# EAGLE schematic GPS_radiologger_v3 (EAGLE 9.5.1)
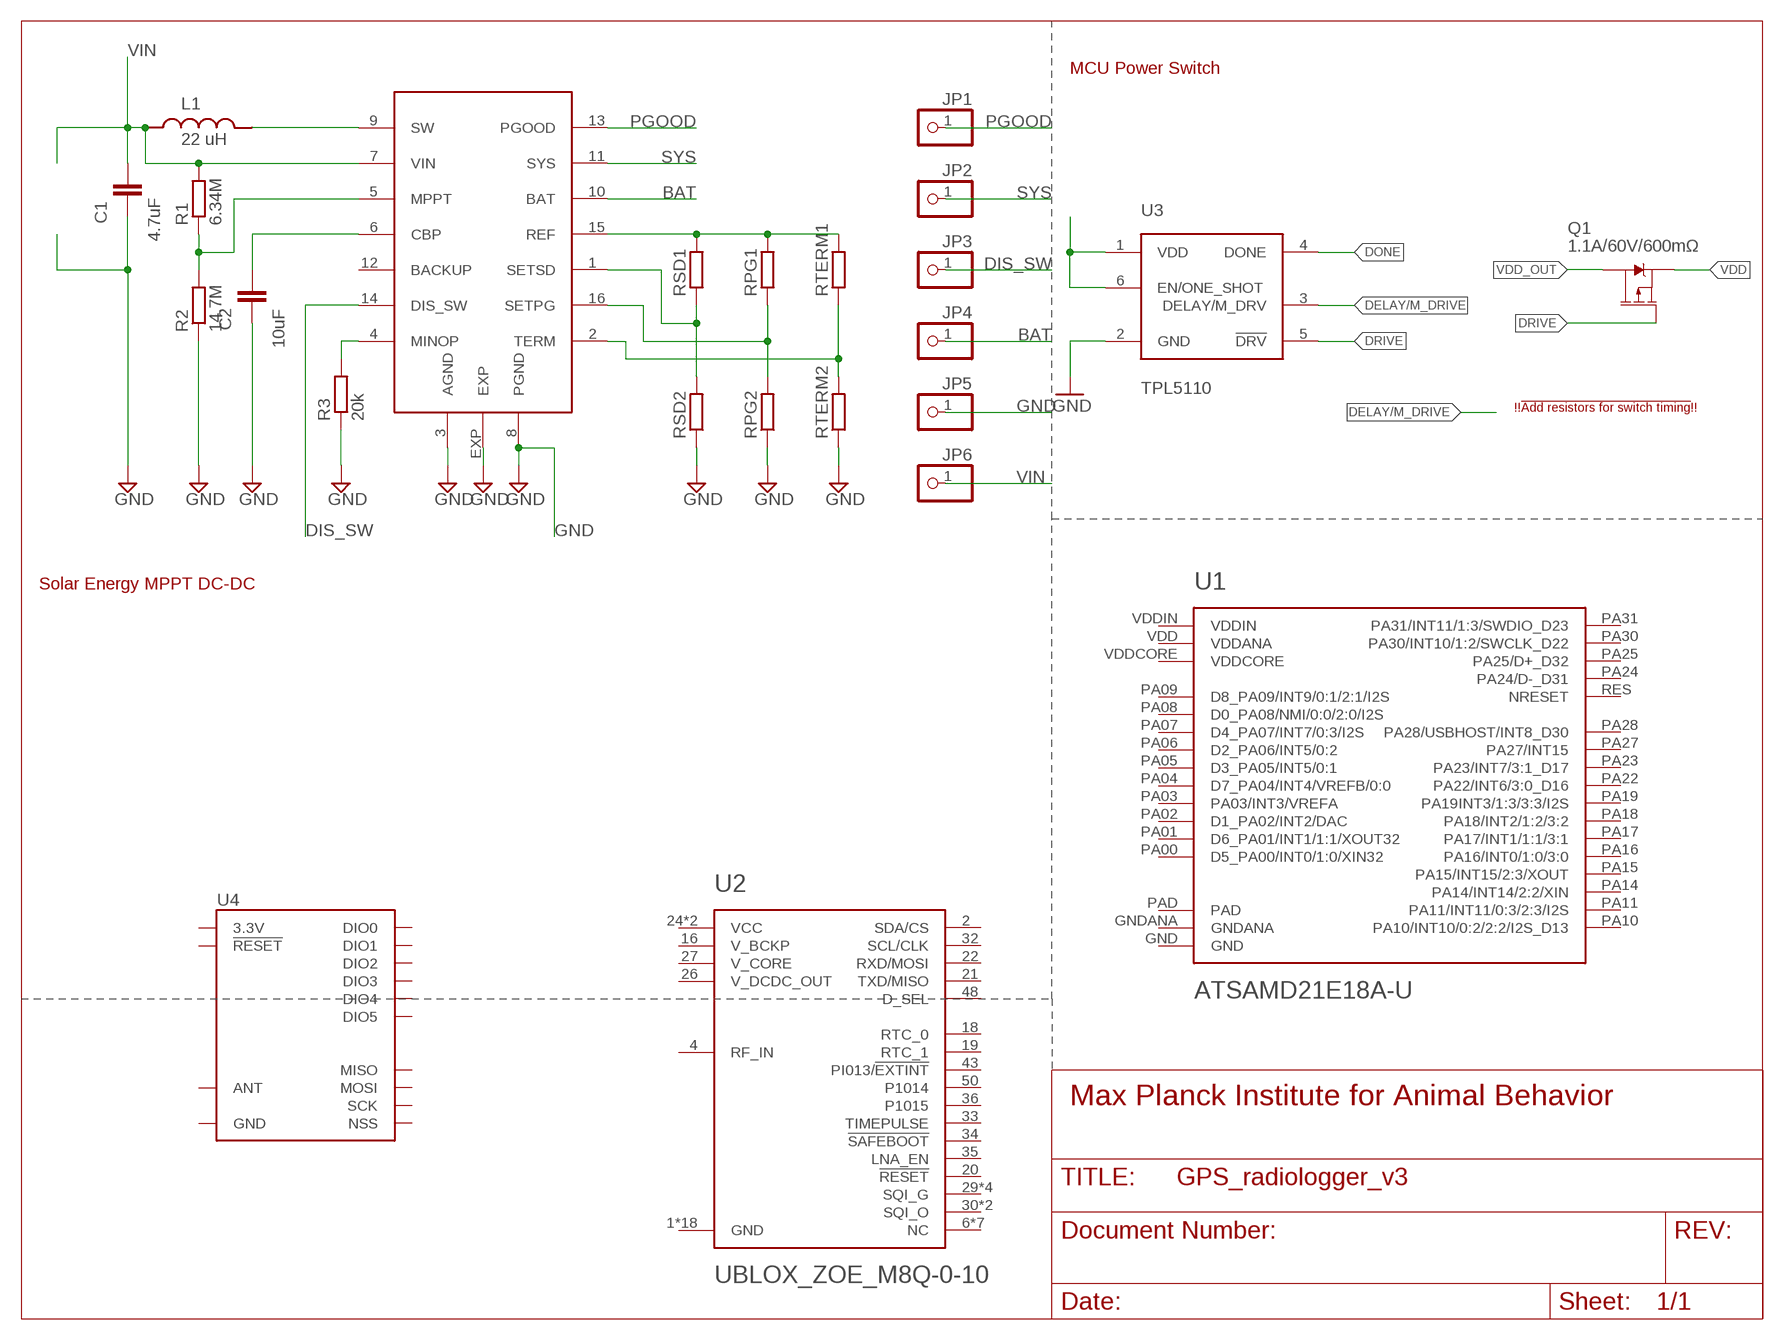
[diagram p0: schematic, sheet 1]

## Parts
C1  4.7uF  C-EUC0402  [C0402]
C2  10uF  C-EUC0402  [C0402]
JP1  PINHD-1X1  [1X01]
JP2  PINHD-1X1  [1X01]
JP3  PINHD-1X1  [1X01]
JP4  PINHD-1X1  [1X01]
JP5  PINHD-1X1  [1X01]
JP6  PINHD-1X1  [1X01]
L1  22 uH  LPS4012-103MRB  [IND_LPS4012-103MRB]
Q1  1.1A/60V/600mΩ  MOSFET_PCH-SI2309DS  [SOT23-3]
R1  6.34M  R-EU_R0201  [R0201]
R2  14.7M  R-EU_R0201  [R0201]
R3  20k  R-EU_R0201  [R0201]
RPG1  R-EU_R0201  [R0201]
RPG2  R-EU_R0201  [R0201]
RSD1  R-EU_R0402  [R0402]
RSD2  R-EU_R0201  [R0201]
RTERM1  R-EU_R0402  [R0402]
RTERM2  R-EU_R0201  [R0201]
U1  ATSAMD21E18A-U  [QFN-32_SAMD]
U2  UBLOX_ZOE_M8Q-0-10  [UBLOX_ZOE_M8-0-10]
U3  TPL5110  [SOT23-6]
U4  RFM95W  [RFM95/96/97/98W]
U$2  ADP5090  [LFCSP-16-3X3]

## Nets
BAT: JP4.1 U$2.10(BAT)
DELAY/M_DRIVE: U3.3(DELAY/M_DRV)
DIS_SW: JP3.1 U$2.14(DIS_SW)
DONE: U3.4(DONE)
DRIVE: Q1.1(G) U3.5(!DRV)
GND: C1.2 C2.2 JP5.1 R2.1 R3.1 RPG2.1 RSD2.1 RTERM2.1 U3.2(GND) U$2.3(AGND) U$2.8(PGND) U$2.EXP
N$1: R1.1 R2.2 U$2.5(MPPT)
N$2: C2.1 U$2.6(CBP)
N$3: L1.2 U$2.9(SW)
N$5: R3.2 U$2.4(MINOP)
N$6: U3.1(VDD) U3.6(EN/ONE_SHOT)
N$7: RTERM1.1 RTERM2.2 U$2.2(TERM)
N$8: RPG1.1 RPG2.2 U$2.16(SETPG)
N$9: RSD1.1 RSD2.2 U$2.1(SETSD)
N$11: RPG1.2 RSD1.2 RTERM1.2 U$2.15(REF)
PGOOD: JP1.1 U$2.13(PGOOD)
SYS: JP2.1 U$2.11(SYS)
VDD: Q1.2(S)
VDD_OUT: Q1.3(D)
VIN: C1.1 JP6.1 L1.1 R1.2 U$2.7(VIN)
Unconnected: U1.PA00(D5_PA00/INT0/1:0/XIN32) U1.PA01(D6_PA01/INT1/1:1/XOUT32) U1.PA02(D1_PA02/INT2/DAC) U1.PA03(PA03/INT3/VREFA) U1.PA04(D7_PA04/INT4/VREFB/0:0) U1.PA05(D3_PA05/INT5/0:1) U1.PA06(D2_PA06/INT5/0:2) U1.PA07(D4_PA07/INT7/0:3/I2S) U1.PA08(D0_PA08/NMI/0:0/2:0/I2S) U1.PA09(D8_PA09/INT9/0:1/2:1/I2S) U1.PA10(PA10/INT10/0:2/2:2/I2S_D13) U1.PA11(PA11/INT11/0:3/2:3/I2S) U1.PA14(PA14/INT14/2:2/XIN) U1.PA15(PA15/INT15/2:3/XOUT) U1.PA16(PA16/INT0/1:0/3:0) U1.PA17(PA17/INT1/1:1/3:1) U1.PA18(PA18/INT2/1:2/3:2) U1.PA19(PA19INT3/1:3/3:3/I2S) U1.PA22(PA22/INT6/3:0_D16) U1.PA23(PA23/INT7/3:1_D17) U1.PA24(PA24/D-_D31) U1.PA25(PA25/D+_D32) U1.PA27(PA27/INT15) U1.PA28(PA28/USBHOST/INT8_D30) U1.PA30(PA30/INT10/1:2/SWCLK_D22) U1.PA31(PA31/INT11/1:3/SWDIO_D23) U1.RES(NRESET) U2.2(SDA/CS) U2.4(RF_IN) U2.6(NC) U2.13(NC) U2.14(NC) U2.15(NC) U2.18(RTC_0) U2.19(RTC_1) U2.20(!RESET) U2.21(TXD/MISO) U2.22(RXD/MOSI) U2.28(NC) U2.29(SQI_G) U2.30(SQI_O) U2.31(SQI_G) U2.32(SCL/CLK) U2.33(TIMEPULSE) U2.34(!SAFEBOOT) U2.35(LNA_EN) U2.36(P1015) U2.42(NC) U2.43(PI013/!EXTINT) U2.45(SQI_O) U2.46(SQI_G) U2.47(SQI_G) U2.48(D_SEL) U2.50(P1014) U2.51(NC) U4.3.3V U4.!RESET U4.ANT U4.DIO0 U4.DIO1 U4.DIO2 U4.DIO3 U4.DIO4 U4.DIO5 U4.GND@1(GND) U4.GND@2(GND) U4.GND@3(GND) U4.MISO U4.MOSI U4.NSS U4.SCK U$2.12(BACKUP)

## Notes on the sheet
- MCU Power Switch
- !!!Add resistors for switch timing!!!
- Solar Energy MPPT DC-DC
- Max Planck Institute for Animal Behavior

## Power pins joined to a net without a drawn wire
GND: U1.GND U2.1(GND) U2.3(GND) U2.5(GND) U2.7(GND) U2.8(GND) U2.9(GND) U2.10(GND) U2.11(GND) U2.12(GND) U2.17(GND) U2.23(GND) U2.37(GND) U2.38(GND) U2.39(GND) U2.40(GND) U2.41(GND) U2.44(GND) U2.49(GND)
GNDANA: U1.GNDANA
PAD: U1.PAD
V_BCKP: U2.16(V_BCKP)
V_CORE: U2.27(V_CORE)
V_DCDC_OUT: U2.26(V_DCDC_OUT)
VCC: U2.24(VCC) U2.25(VCC)
VDDANA: U1.VDD(VDDANA)
VDDCORE: U1.VDDCORE
VDDIN: U1.VDDIN

## Library data of the parts
C1 C2 = resistor:C-EU: CAPACITOR, European symbol
JP1-JP6 = pinhead:PINHD-1X1: PIN HEADER
L1 = LPS4012-103MRB:LPS4012-103MRB: Power inductor, shielded, 20/30% tol, SMT, RoHS, lead-free, halogen-free; AVAILABILITY: Unavailable; DESCRIPTION: Power inductor, shielded, 20/30% tol, SMT, RoHS, lead-free, halogen-free; MF: Coilcraft; MP: LPS4012-103MRB; PACKAGE: None; PRICE: None
Q1 = SparkFun-DiscreteSemi:MOSFET_PCH: P-channel MOSFETs Voltage controlled devices that allow control of high current outputs. SparkFun Products: SparkFun ESP32 Thing <https://www.sparkfun.com/products/13907> SparkFun ESP8266 Thing <https://www.sparkfun.com/products/13231>; PROD_ID: TRANS-08285
R1-R3 RPG1 RPG2 RSD2 RTERM2 = resistor:R-EU_: RESISTOR, European symbol
RSD1 RTERM1 = rcl:R-EU_: RESISTOR, European symbol; SPICEPREFIX: R
U1 = SparkFun-IC-Microcontroller:ATSAMD21E18A-U: SAM D21E 32-Pin QFN The SAMD21E is built around the 32-bit ARM Cortex-M0+ processor with up to 256KB of Flash and 32KB of SRAM. It operates at a maximum frequency of 48MHz.; PROD_ID: IC-14428
U2 = SparkFun-GPS:UBLOX_ZOE_M8Q-0-10: UBLOX ZOE-M8Q-0-10 u-blox ZOE-M8 standard precision GNSS SiP (System in Package) modules feature the high performance u-blox M8 GNSS engine. ZOE-M8’s ultra-miniature form factor integrates a complete GNSS receiver including SAW filter, LNA and TCXO. Handles all GNSS systems and can simulatenously use up to three of them, with accuracy ranging from 2.5m to 4m. GPS GLONASS BeiDou Galileo This can be corrected with the SBAS or QZSS augmentation systems.; PROD_ID: IC-14251
U3 = SparkFun-IC-Power:TPL5110: TPL5110 Nano-Power System Timer for Power Gating The TPL5110 Nano Timer is a low power timer with an integrated MOSFET driver designed for power gating in duty cycled or battery-powered applications. Consuming only 35 nA, the TPL5110 can enable the power supply line and drastically reduce the overall system stand by current during the sleep time.; PROD_ID: IC-14387
U4 = SparkFun-RF:RFM95W: RFM95/96/97/98 The RFM95/96/97/98(W) transceivers feature the LoRaTM long range modem that provides ultra-long range spread spectrum communication and high interference immunity whilst minimising current consumption. These devices also support high performance (G)FSK modes for systems including WMBus, IEEE802.15.4g. The RFM95/96/97/98(W) deliver exceptional phase noise, selectivity, receiver linearity and IIP3 for significantly lower current consumption than competing devices Datasheet <http://www.hoperf.com/upload/rf/RFM95_96_97_98W.pdf>; PROD_ID: IC-13959
U$2 = ADP5090_LFCSP-16-3X3:ADP5090